# EasyEDA schematic u.json
TITLE: Alcor AU6989 USB2.0 U盘 安国; REV: 1.4; Date: 2021-06-30; Sheet: 1/1; Drawn By: GloomyGhost; Company: YuzukiTsuru
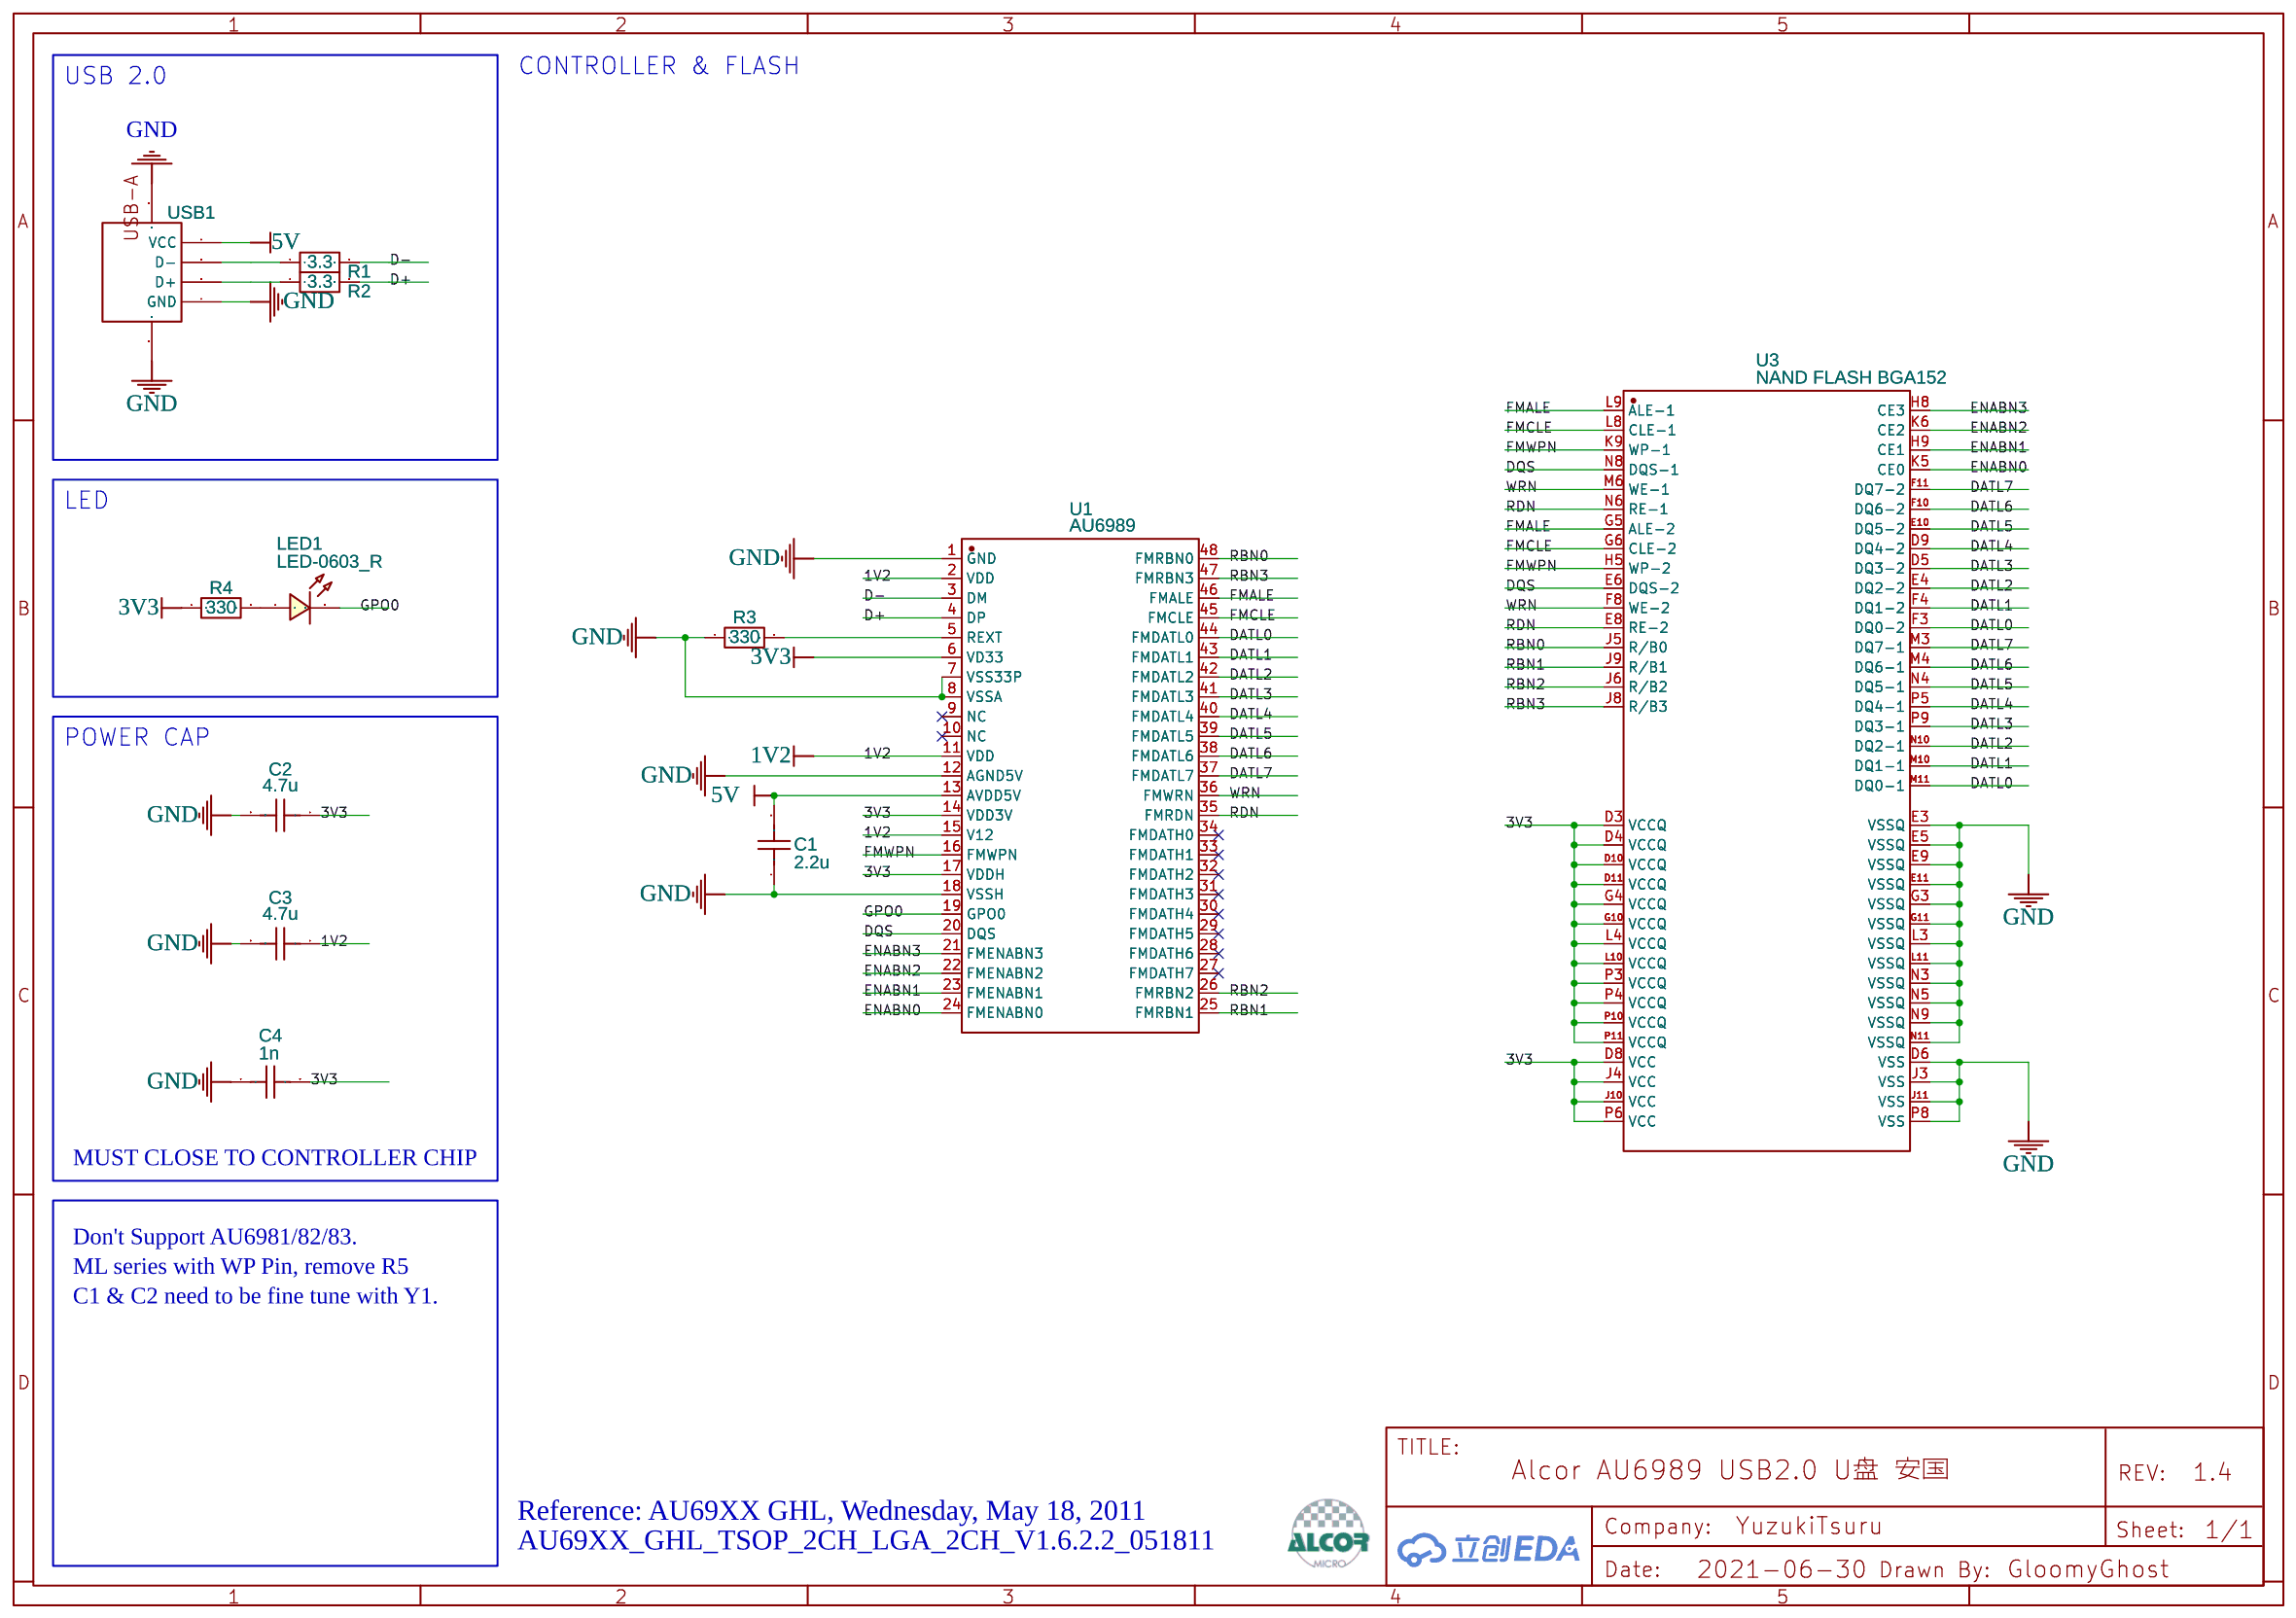
[diagram p0: schematic sheet]

## Parts
C1  2.2u  [C0402-NSK]
C2  4.7u  [C0402-NSK]
C3  4.7u  [C0402-NSK]
C4  1n  [C0402-NSK]
LED1  LED-0603_R  [LED0603 NSK]
R1  3.3  [R0402-NSK]
R2  3.3  [R0402-NSK]
R3  330  [R0402-NSK]
R4  330  [R0402-NSK]
U1  AU6989  [LQFP48_W]
U3  NAND FLASH BGA152  [BGA152 LL]
USB1  USB-A-A/M Stick plate bent legs VinylPBT With a column  [USB-A-SMD-YUZUKI]

## Library data of the parts
C1-C4 = C_0603_US: Contributor: LCEDA_Lib
LED1 = LED-0603_R: Manufacturer: EVERLIGHT(台湾亿光); Manufacturer Part: 19-217/R6C-AL1M2VY/3T; Supplier Part: C72044; Supplier: LCSC; Contributor: LCEDA_01
R1-R4 = R_0603_EU: Contributor: LCEDA_Lib
U1 = AU6989: Contributor: GloomyGhost
U3 = NAND FLASH BGA152: Contributor: GloomyGhost
USB1 = USB-A-A/M Stick plate bent legs VinylPBT With a column: Supplier: LCSC; Manufacturer: ValuePro; Manufacturer Part: A/M Stick plate bent legs VinylPBT With a column; Supplier Part: C46394

## Nets
1V2: C3.1 U1.2(VDD) U1.11(VDD) U1.15(V12)
3V3: C2.1 C4.2 R4.1 U1.6(VD33) U1.14(VDD3V) U1.17(VDDH) U3.D3(VCCQ) U3.D4(VCCQ) U3.D8(VCC) U3.D10(VCCQ) U3.D11(VCCQ) U3.G4(VCCQ) U3.G10(VCCQ) U3.J4(VCC) U3.J10(VCC) U3.L4(VCCQ) U3.L10(VCCQ) U3.P3(VCCQ) U3.P4(VCCQ) U3.P6(VCC) U3.P10(VCCQ) U3.P11(VCCQ)
5V: C1.2 U1.13(AVDD5V) USB1.1(VCC)
GND: C1.1 C2.2 C3.2 C4.1 R3.1 U1.1(GND) U1.7(VSS33P) U1.8(VSSA) U1.12(AGND5V) U1.18(VSSH) U3.D6(VSS) U3.E3(VSSQ) U3.E5(VSSQ) U3.E9(VSSQ) U3.E11(VSSQ) U3.G3(VSSQ) U3.G11(VSSQ) U3.J3(VSS) U3.J11(VSS) U3.L3(VSSQ) U3.L11(VSSQ) U3.N3(VSSQ) U3.N5(VSSQ) U3.N9(VSSQ) U3.N11(VSSQ) U3.P8(VSS) USB1.4(GND) USB1.5 USB1.6
D+: R2.2 U1.4(DP)
D-: R1.2 U1.3(DM)
DATL0: U1.44(FMDATL0) U3.F3(DQ0-2) U3.M11(DQ0-1)
DATL1: U1.43(FMDATL1) U3.F4(DQ1-2) U3.M10(DQ1-1)
DATL2: U1.42(FMDATL2) U3.E4(DQ2-2) U3.N10(DQ2-1)
DATL3: U1.41(FMDATL3) U3.D5(DQ3-2) U3.P9(DQ3-1)
DATL4: U1.40(FMDATL4) U3.D9(DQ4-2) U3.P5(DQ4-1)
DATL5: U1.39(FMDATL5) U3.E10(DQ5-2) U3.N4(DQ5-1)
DATL6: U1.38(FMDATL6) U3.F10(DQ6-2) U3.M4(DQ6-1)
DATL7: U1.37(FMDATL7) U3.F11(DQ7-2) U3.M3(DQ7-1)
DQS: U1.20(DQS) U3.E6(DQS-2) U3.N8(DQS-1)
ENABN0: U1.24(FMENABN0) U3.K5(CE0)
ENABN1: U1.23(FMENABN1) U3.H9(CE1)
ENABN2: U1.22(FMENABN2) U3.K6(CE2)
ENABN3: U1.21(FMENABN3) U3.H8(CE3)
FMALE: U1.46(FMALE) U3.G5(ALE-2) U3.L9(ALE-1)
FMCLE: U1.45(FMCLE) U3.G6(CLE-2) U3.L8(CLE-1)
FMWPN: U1.16(FMWPN) U3.H5(WP-2) U3.K9(WP-1)
GPO0: LED1.2 U1.19(GPO0)
RBN0: U1.48(FMRBN0) U3.J5(R/B0)
RBN1: U1.25(FMRBN1) U3.J9(R/B1)
RBN2: U1.26(FMRBN2) U3.J6(R/B2)
RBN3: U1.47(FMRBN3) U3.J8(R/B3)
RDN: U1.35(FMRDN) U3.E8(RE-2) U3.N6(RE-1)
WRN: U1.36(FMWRN) U3.F8(WE-2) U3.M6(WE-1)
Net-(LED1-1): LED1.1 R4.2
Net-(R1-1): R1.1 USB1.2(D-)
Net-(R2-1): R2.1 USB1.3(D+)
Net-(R3-2): R3.2 U1.5(REXT)

Not connected (* = marked no-connect by the designer): U1 9(NC)* 10(NC)* 27(FMDATH7)* 28(FMDATH6)* 29(FMDATH5)* 30(FMDATH4)* 31(FMDATH3)* 32(FMDATH2)* 33(FMDATH1)* 34(FMDATH0)*

## Notes on the sheet
- USB 2.0
- CONTROLLER & FLASH
- LED
- POWER CAP
- MUST CLOSE TO CONTROLLER CHIP
- Don't Support AU6981/82/83.
- ML series with WP Pin, remove R5
- C1 & C2 need to be fine tune with Y1.
- Reference: AU69XX GHL, Wednesday, May 18, 2011
- AU69XX_GHL_TSOP_2CH_LGA_2CH_V1.6.2.2_051811
